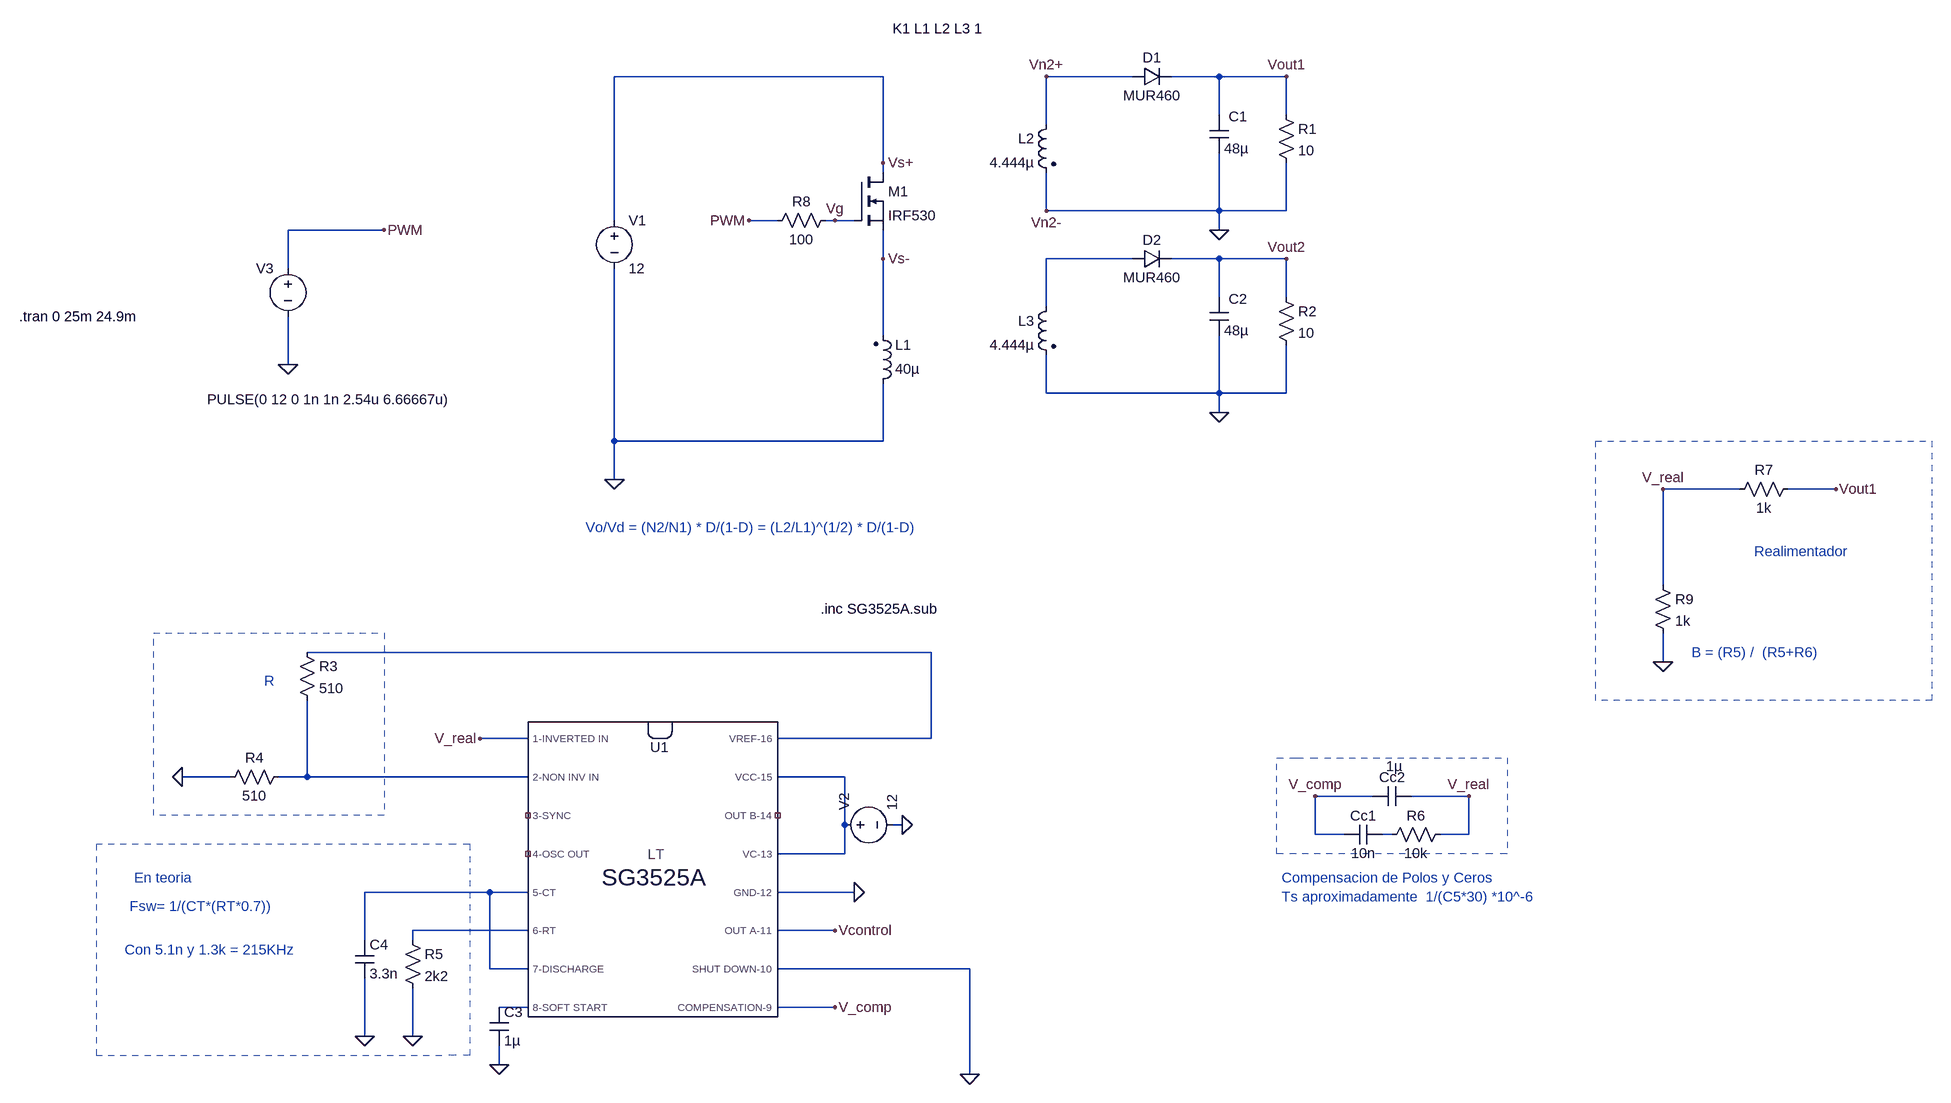
[diagram p0: schematic FlyBack.asc]
FlyBack.asc, the LTspice schematic file:
Version 4
SHEET 1 2728 2048
WIRE 48 -240 -400 -240
WIRE 464 -240 320 -240
WIRE 608 -240 528 -240
WIRE 720 -240 608 -240
WIRE 608 -176 608 -240
WIRE 720 -176 720 -240
WIRE 320 -160 320 -240
WIRE 48 -96 48 -240
WIRE 48 -80 48 -96
WIRE 320 -16 320 -80
WIRE 608 -16 608 -112
WIRE 608 -16 320 -16
WIRE 720 -16 720 -96
WIRE 720 -16 608 -16
WIRE -400 0 -400 -240
WIRE -128 0 -176 0
WIRE -32 0 -48 0
WIRE 0 0 -32 0
WIRE -784 16 -944 16
WIRE 608 16 608 -16
WIRE 48 64 48 16
WIRE 464 64 320 64
WIRE 608 64 528 64
WIRE 720 64 608 64
WIRE -944 80 -944 16
WIRE 608 128 608 64
WIRE 720 128 720 64
WIRE 320 144 320 64
WIRE 48 192 48 64
WIRE -944 240 -944 160
WIRE 320 288 320 224
WIRE 608 288 608 192
WIRE 608 288 320 288
WIRE 720 288 720 208
WIRE 720 288 608 288
WIRE 608 320 608 288
WIRE -400 368 -400 80
WIRE 48 368 48 272
WIRE 48 368 -400 368
WIRE -400 432 -400 368
WIRE 1584 448 1456 448
WIRE 1744 448 1664 448
WIRE 1456 608 1456 448
WIRE 128 720 -912 720
WIRE 1456 736 1456 688
WIRE -544 864 -624 864
WIRE 128 864 128 720
WIRE 128 864 -128 864
WIRE -1040 928 -1120 928
WIRE -912 928 -912 800
WIRE -912 928 -960 928
WIRE -544 928 -912 928
WIRE -16 928 -128 928
WIRE 864 960 768 960
WIRE 1024 960 928 960
WIRE -16 1008 -16 928
WIRE 80 1008 64 1008
WIRE 768 1024 768 960
WIRE 816 1024 768 1024
WIRE 896 1024 880 1024
WIRE 1024 1024 1024 960
WIRE 1024 1024 976 1024
WIRE -16 1056 -16 1008
WIRE -16 1056 -128 1056
WIRE -608 1120 -816 1120
WIRE -544 1120 -608 1120
WIRE 0 1120 -128 1120
WIRE -544 1184 -736 1184
WIRE -32 1184 -128 1184
WIRE -816 1200 -816 1120
WIRE -736 1200 -736 1184
WIRE -608 1248 -608 1120
WIRE -544 1248 -608 1248
WIRE 192 1248 -128 1248
WIRE -544 1312 -592 1312
WIRE -32 1312 -128 1312
WIRE -816 1360 -816 1264
WIRE -736 1360 -736 1280
WIRE -592 1408 -592 1376
WIRE 192 1424 192 1248
FLAG -400 432 0
FLAG 720 -240 Vout1
FLAG -944 240 0
FLAG -784 16 PWM
FLAG -176 0 PWM
FLAG 608 16 0
FLAG 720 64 Vout2
FLAG 608 320 0
FLAG 48 -96 Vs+
FLAG 48 64 Vs-
FLAG 320 -240 Vn2+
FLAG 320 -16 Vn2-
FLAG -32 0 Vg
FLAG 0 1120 0
FLAG -1120 928 0
FLAG -32 1184 Vcontrol
FLAG 192 1424 0
FLAG -592 1408 0
FLAG -736 1360 0
FLAG -816 1360 0
FLAG 80 1008 0
FLAG -624 864 V_real
FLAG 1024 960 V_real
FLAG -32 1312 V_comp
FLAG 768 960 V_comp
FLAG 1456 736 0
FLAG 1744 448 Vout1
FLAG 1456 448 V_real
SYMBOL nmos 0 -80 R0
SYMATTR InstName M1
SYMATTR Value IRF530
SYMBOL diode 464 -224 R270
WINDOW 0 32 32 VTop 2
WINDOW 3 0 32 VBottom 2
SYMATTR InstName D1
SYMATTR Value MUR460
SYMBOL voltage -400 -16 R0
WINDOW 123 0 0 Left 0
WINDOW 39 0 0 Left 0
SYMATTR InstName V1
SYMATTR Value 12
SYMBOL res -32 -16 R90
WINDOW 0 0 56 VBottom 2
WINDOW 3 32 56 VTop 2
SYMATTR InstName R8
SYMATTR Value 100
SYMBOL cap 592 -176 R0
WINDOW 0 32 3 Left 2
SYMATTR InstName C1
SYMATTR Value 48µ
SYMBOL res 704 -192 R0
SYMATTR InstName R1
SYMATTR Value 10
SYMBOL voltage -944 64 M0
WINDOW 3 -270 235 Left 2
WINDOW 123 0 0 Left 0
WINDOW 39 0 0 Left 0
SYMATTR Value PULSE(0 12 0 1n 1n 2.54u 6.66667u)
SYMATTR InstName V3
SYMBOL ind2 32 288 M180
WINDOW 0 36 80 Left 2
WINDOW 3 36 40 Left 2
SYMATTR InstName L1
SYMATTR Value 40µ
SYMATTR Type ind
SYMBOL ind2 336 -176 M0
SYMATTR InstName L2
SYMATTR Value 4.444µ
SYMATTR Type ind
SYMBOL diode 464 80 R270
WINDOW 0 32 32 VTop 2
WINDOW 3 0 32 VBottom 2
SYMATTR InstName D2
SYMATTR Value MUR460
SYMBOL cap 592 128 R0
WINDOW 0 32 3 Left 2
SYMATTR InstName C2
SYMATTR Value 48µ
SYMBOL res 704 112 R0
SYMATTR InstName R2
SYMATTR Value 10
SYMBOL ind2 336 128 M0
SYMATTR InstName L3
SYMATTR Value 4.444µ
SYMATTR Type ind
SYMBOL res -928 704 R0
SYMATTR InstName R3
SYMATTR Value 510
SYMBOL res -944 912 R90
WINDOW 0 0 56 VBottom 2
WINDOW 3 32 56 VTop 2
SYMATTR InstName R4
SYMATTR Value 510
SYMBOL cap -608 1312 R0
SYMATTR InstName C3
SYMATTR Value 1µ
SYMBOL res -752 1184 R0
SYMATTR InstName R5
SYMATTR Value 2k2
SYMBOL cap -832 1200 R0
SYMATTR InstName C4
SYMATTR Value 3.3n
SYMBOL SG3525A -400 960 R0
SYMATTR InstName U1
SYMATTR Value SG3525A
SYMBOL cap 880 1008 R90
WINDOW 0 0 32 VBottom 2
WINDOW 3 32 32 VTop 2
SYMATTR InstName Cc1
SYMATTR Value 10n
SYMBOL res 992 1008 R90
WINDOW 0 0 56 VBottom 2
WINDOW 3 32 56 VTop 2
SYMATTR InstName R6
SYMATTR Value 10k
SYMBOL cap 928 944 R90
WINDOW 0 0 32 VBottom 2
WINDOW 3 -49 28 VTop 2
SYMATTR InstName Cc2
SYMATTR Value 1µ
SYMBOL voltage -32 1008 R270
WINDOW 123 0 0 Left 0
WINDOW 39 0 0 Left 0
SYMATTR InstName V2
SYMATTR Value 12
SYMBOL res 1680 432 R90
WINDOW 0 0 56 VBottom 2
WINDOW 3 32 56 VTop 2
SYMATTR InstName R7
SYMATTR Value 1k
SYMBOL res 1440 592 R0
SYMATTR InstName R9
SYMATTR Value 1k
TEXT -1392 160 Left 2 !.tran 0 25m 24.9m
TEXT -448 512 Left 2 ;Vo/Vd = (N2/N1) * D/(1-D) = (L2/L1)^(1/2) * D/(1-D)
TEXT 64 -320 Left 2 !K1 L1 L2 L3 1
TEXT 712 1096 Left 2 ;Compensacion de Polos y Ceros
TEXT 712 1128 Left 2 ;Ts aproximadamente  1/(C5*30) *10^-6
TEXT -1200 1096 Left 2 ;En teoria
TEXT -1208 1144 Left 2 ;Fsw= 1/(CT*(RT*0.7))
TEXT -1216 1216 Left 2 ;Con 5.1n y 1.3k = 215KHz
TEXT -984 768 Left 2 ;R
TEXT 1608 552 Left 2 ;Realimentador
TEXT 1504 720 Left 2 ;B = (R5) /  (R5+R6)
TEXT -56 648 Left 2 !.inc SG3525A.sub
LINE Normal -640 1392 -640 1040 2
LINE Normal -1264 1392 -688 1392 2
LINE Normal -1264 1040 -1264 1392 2
LINE Normal -688 1040 -1264 1040 2
LINE Normal 1040 1056 736 1056 2
LINE Normal 1088 896 1088 1056 2
LINE Normal 784 896 1088 896 2
LINE Normal 736 896 784 896 2
LINE Normal 1088 1056 1040 1056 2
LINE Normal 704 896 736 896 2
LINE Normal 704 1056 704 896 2
LINE Normal 736 1056 704 1056 2
LINE Normal -640 1040 -688 1040 2
LINE Normal -640 1392 -688 1392 2
RECTANGLE Normal -784 992 -1168 688 2
RECTANGLE Normal 1904 800 1344 368 2

The netlist it stands for:
* FlyBack.asc
M1 Vs+ Vg Vs- Vs- IRF530
D1 Vn2+ Vout1 MUR460
V1 Vs+ 0 12
R8 Vg PWM 100
C1 Vout1 0 48µ
R1 Vout1 0 10
V3 PWM 0 PULSE(0 12 0 1n 1n 2.54u 6.66667u)
L1 0 Vs- 40µ
L2 Vn2+ 0 4.444µ
D2 N001 Vout2 MUR460
C2 Vout2 0 48µ
R2 Vout2 0 10
L3 N001 0 4.444µ
R3 N002 N003 510
R4 N003 0 510
C3 N008 0 1µ
R5 N007 0 2k2
C4 N006 0 3.3n
XU1 V_real N003 NC_01 NC_02 N006 N007 N006 N008 V_comp 0 Vcontrol 0 N004 NC_03 N004 N002 SG3525A  ; pins 1-INVERTED_IN 2-NON_INV_IN 3-SYNC 4-OSC_OUT 5-CT 6-RT 7-DISCHARGE 8-SOFT_START COMPENSATION-9 SHUT_DOWN-10 OUT_A-11 GND-12 VC-13 OUT_B-14 VCC-15 VREF-16
Cc1 N005 V_comp 10n
R6 V_real N005 10k
Cc2 V_real V_comp 1µ
V2 N004 0 12
R7 Vout1 V_real 1k
R9 V_real 0 1k
.model D D
.lib standard.dio
.model NMOS NMOS
.model PMOS PMOS
.lib standard.mos
.tran 0 25m 24.9m
* Vo/Vd = (N2/N1) * D/(1-D) = (L2/L1)^(1/2) * D/(1-D)
K1 L1 L2 L3 1
* Compensacion de Polos y Ceros
* Ts aproximadamente  1/(C5*30) *10^-6
* En teoria
* Fsw= 1/(CT*(RT*0.7))
* Con 5.1n y 1.3k = 215KHz
* R
* Realimentador
* B = (R5) /  (R5+R6)
.inc SG3525A.sub
.backanno
.end